# EAGLE schematic hand_rev_1_3_c (EAGLE 9.4.2)
DATE: 2019.07.02; REV: 1.2b
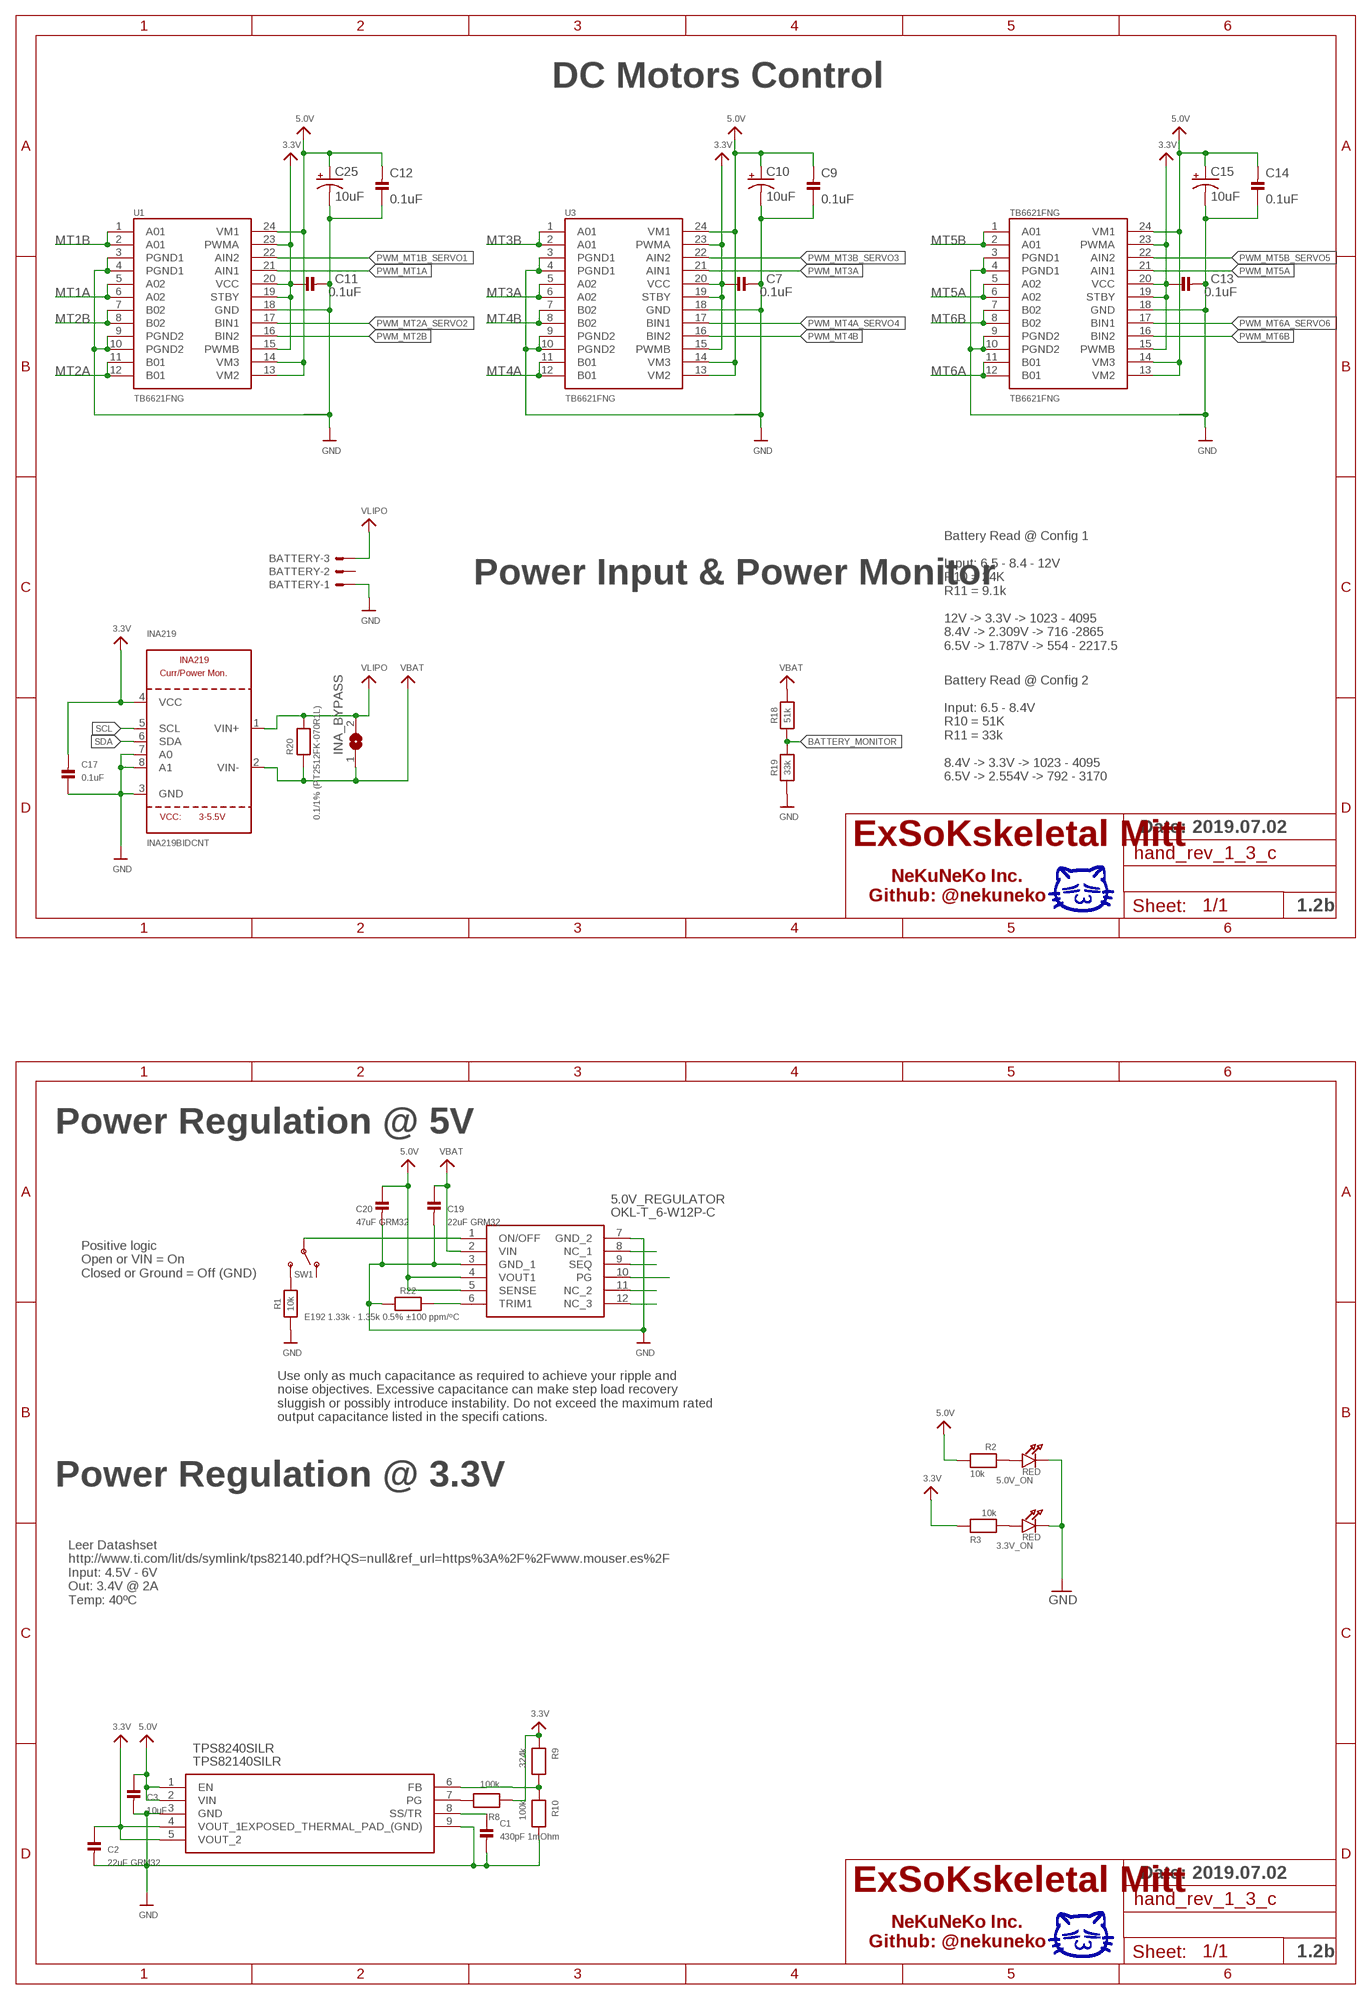
[diagram p0: schematic, sheet 1, part 1 of 2]
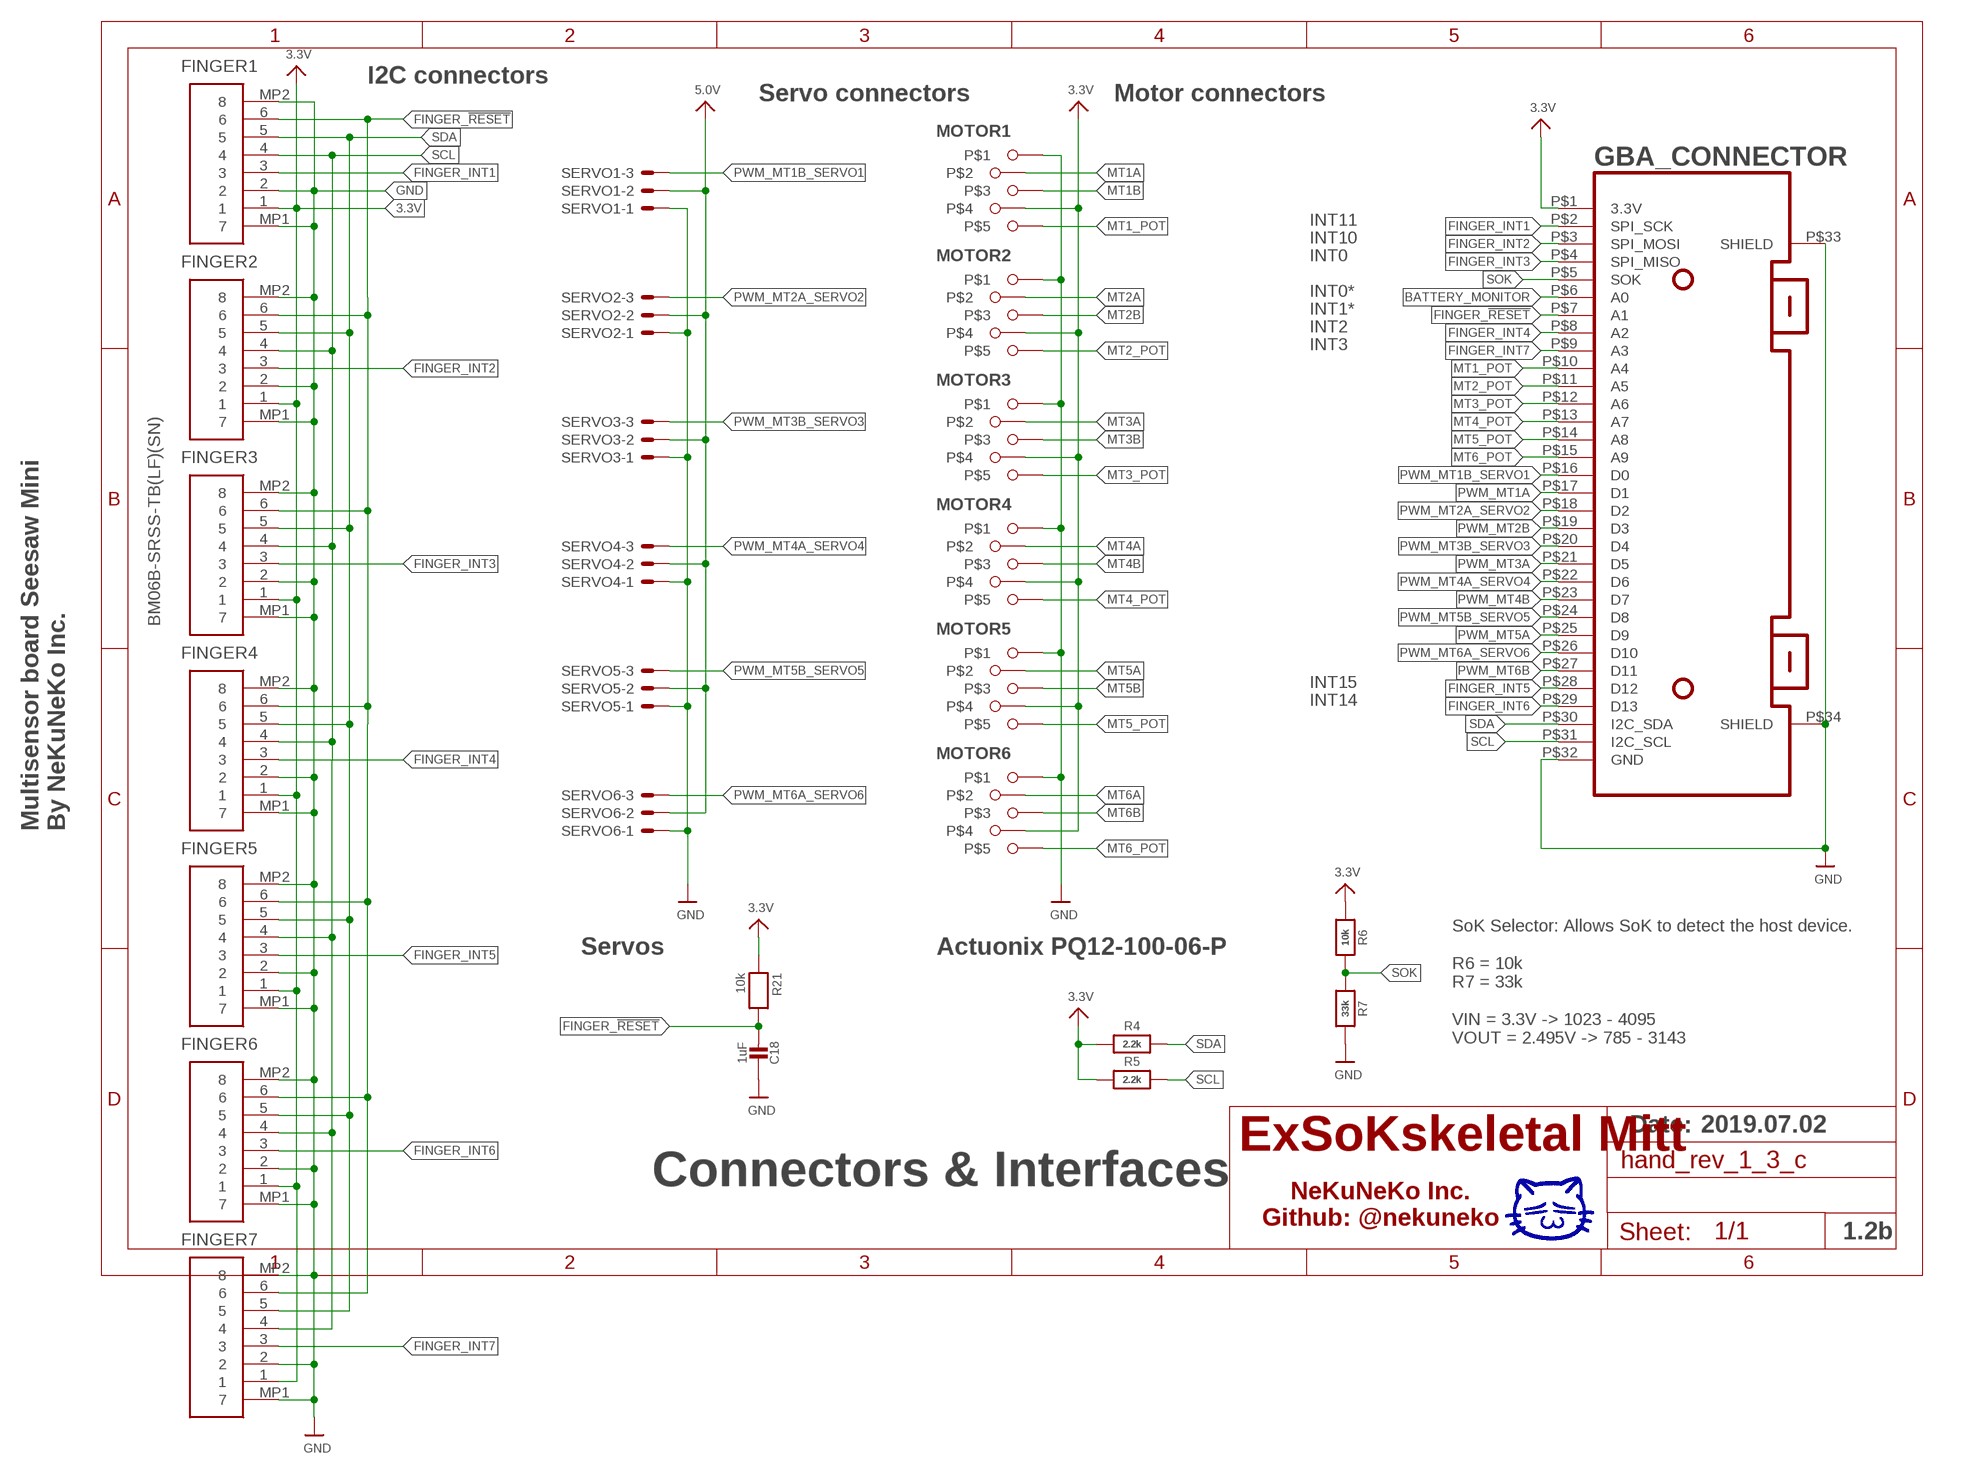
[diagram p1: schematic, sheet 1, part 2 of 2]

## Parts
3.3V_ON  RED  LED0603  [CHIPLED_0603]
5.0V_ON  RED  LED0603  [CHIPLED_0603]
5.0V_REGULATOR  OKL-T_6-W12P-C  [OKL-T3-W12]
BATTERY  JST-XH-03-PIN-LONG-PAD  [JST-XH-03-PACKAGE-LONG-PAD]
C1  430pF 1mOhm  CAP_CERAMIC_0402  [_0402]
C2  22uF GRM32  CAP_CERAMIC_0603  [_0603]
C3  10uF  CAP_CERAMIC_0603  [_0603]
C7  0.1uF  CAP_CERAMIC_0603  [_0603]
C9  0.1uF  CAP_CERAMIC_0603  [_0603]
C10  10uF  10UF-POLAR-0603-6.3V-20%(TANT)  [0603-POLAR]
C11  0.1uF  CAP_CERAMIC_0603  [_0603]
C12  0.1uF  CAP_CERAMIC_0603  [_0603]
C13  0.1uF  CAP_CERAMIC_0603  [_0603]
C14  0.1uF  CAP_CERAMIC_0603  [_0603]
C15  10uF  10UF-POLAR-0603-6.3V-20%(TANT)  [0603-POLAR]
C17  0.1uF  CAP_CERAMIC_0603  [_0603]
C18  1uF  CAP_CERAMIC_0603  [MICROBUILDER__0603]
C19  22uF GRM32  CAP_CERAMIC0805  [0805]
C20  47uF GRM32  CAP_CERAMIC0805  [0805]
C25  10uF  10UF-POLAR-0603-6.3V-20%(TANT)  [0603-POLAR]
FINGER1  BM06B-SRSS-TB(LF)(SN)  [BM06BSRSSTBLFSN]
FINGER2  BM06B-SRSS-TB(LF)(SN)  [BM06BSRSSTBLFSN]
FINGER3  BM06B-SRSS-TB(LF)(SN)  [BM06BSRSSTBLFSN]
FINGER4  BM06B-SRSS-TB(LF)(SN)  [BM06BSRSSTBLFSN]
FINGER5  BM06B-SRSS-TB(LF)(SN)  [BM06BSRSSTBLFSN]
FINGER6  BM06B-SRSS-TB(LF)(SN)  [BM06BSRSSTBLFSN]
FINGER7  BM06B-SRSS-TB(LF)(SN)  [BM06BSRSSTBLFSN]
GBA_CONNECTOR  GBA_CARTRIDGEGBA_CARTRIDGE2  [GBA_CARTRIDGE2]
INA219  INA219BIDCNT  INA219  [SOT23-8]
INA_BYPASS  SOLDERJUMPERREFLOW_NOPASTE  [SOLDERJUMPER_REFLOW_NOPASTE]
MOTOR1  Actuonix PQ12-100-06-P  5PIN  [5PIN]
MOTOR2  Actuonix PQ12-100-06-P  5PIN  [5PIN]
MOTOR3  Actuonix PQ12-100-06-P  5PIN  [5PIN]
MOTOR4  Actuonix PQ12-100-06-P  5PIN  [5PIN]
MOTOR5  Actuonix PQ12-100-06-P  5PIN  [5PIN]
MOTOR6  Actuonix PQ12-100-06-P  5PIN  [5PIN]
R1  10k  RESISTOR_0603  [_0603]
R2  10k  RESISTOR_0603  [_0603]
R3  10k  RESISTOR_0603  [_0603]
R4  2.2k  RESISTOR_0603  [_0603]
R5  2.2k  RESISTOR_0603  [_0603]
R6  10k  RESISTOR_0603  [_0603]
R7  33k  RESISTOR_0603  [_0603]
R8  100k  RESISTOR_0402  [_0402]
R9  324k  RESISTOR_0402  [_0402]
R10  100k  RESISTOR_0402  [_0402]
R18  51k  RESISTOR_0603  [_0603]
R19  33k  RESISTOR_0603  [_0603]
R20  0.1/1% (PT2512FK-070R1L)  RESISTOR2512  [2512]
R21  10k  RESISTOR_0603  [_0603]
R22  E192 1.33k - 1.35k 0.5% ±100 ppm/ºC  RESISTOR_0603  [_0603]
SERVO1  JST-XH-03-PIN-LONG-PAD  [JST-XH-03-PACKAGE-LONG-PAD]
SERVO2  JST-XH-03-PIN-LONG-PAD  [JST-XH-03-PACKAGE-LONG-PAD]
SERVO3  JST-XH-03-PIN-LONG-PAD  [JST-XH-03-PACKAGE-LONG-PAD]
SERVO4  JST-XH-03-PIN-LONG-PAD  [JST-XH-03-PACKAGE-LONG-PAD]
SERVO5  JST-XH-03-PIN-LONG-PAD  [JST-XH-03-PACKAGE-LONG-PAD]
SERVO6  JST-XH-03-PIN-LONG-PAD  [JST-XH-03-PACKAGE-LONG-PAD]
SW1  SWITCH_SPDT  [SPDT_SMT_SSSS811101]
TB6621FNG  TB6621FNG  [SSOP24]
TPS8240SILR  TPS82140SILR  [SIL0008D]
U1  TB6621FNG  [SSOP24]
U3  TB6621FNG  [SSOP24]

## Nets
3.3V: C2.1 C7.1 C11.1 C13.1 C17.2 FINGER1.1 FINGER2.1 FINGER3.1 FINGER4.1 FINGER5.1 FINGER6.1 FINGER7.1 GBA_CONNECTOR.P$1(3.3V) INA219.4(VCC) MOTOR1.4 MOTOR2.4 MOTOR3.4 MOTOR4.4 MOTOR5.4 MOTOR6.4 R3.1 R4.1 R5.1 R6.1 R8.1 R9.1 R21.1 TB6621FNG.15(PWMB) TB6621FNG.19(STBY) TB6621FNG.20(VCC) TB6621FNG.23(PWMA) TPS8240SILR.4(VOUT_1) TPS8240SILR.5(VOUT_2) U1.15(PWMB) U1.19(STBY) U1.20(VCC) U1.23(PWMA) U3.15(PWMB) U3.19(STBY) U3.20(VCC) U3.23(PWMA)
5.0V: 5.0V_REGULATOR.4(VOUT1) 5.0V_REGULATOR.5(SENSE) C3.1 C9.2 C10.+ C12.2 C14.2 C15.+ C20.1 C25.+ R2.2 SERVO1.2 SERVO2.2 SERVO3.2 SERVO4.2 SERVO5.2 SERVO6.2 TB6621FNG.13(VM2) TB6621FNG.14(VM3) TB6621FNG.24(VM1) TPS8240SILR.1(EN) TPS8240SILR.2(VIN) U1.13(VM2) U1.14(VM3) U1.24(VM1) U3.13(VM2) U3.14(VM3) U3.24(VM1)
5V_GOOD: 5.0V_REGULATOR.10(PG)
BATTERY_MONITOR: GBA_CONNECTOR.P$6(A0) R18.1 R19.2
FINGER_!RESET: C18.2 FINGER1.6 FINGER2.6 FINGER3.6 FINGER4.6 FINGER5.6 FINGER6.6 FINGER7.6 GBA_CONNECTOR.P$7(A1) R21.2
FINGER_INT1: FINGER1.3 GBA_CONNECTOR.P$2(SPI_SCK)
FINGER_INT2: FINGER2.3 GBA_CONNECTOR.P$3(SPI_MOSI)
FINGER_INT3: FINGER3.3 GBA_CONNECTOR.P$4(SPI_MISO)
FINGER_INT4: FINGER4.3 GBA_CONNECTOR.P$8(A2)
FINGER_INT5: FINGER5.3 GBA_CONNECTOR.P$28(D12)
FINGER_INT6: FINGER6.3 GBA_CONNECTOR.P$29(D13)
FINGER_INT7: FINGER7.3 GBA_CONNECTOR.P$9(A3)
GND [gnd]: 3.3V_ON.C 5.0V_ON.C 5.0V_REGULATOR.3(GND_1) 5.0V_REGULATOR.7(GND_2) BATTERY.1 C1.2 C2.2 C3.2 C7.2 C9.1 C10.- C11.2 C12.1 C13.2 C14.1 C15.- C17.1 C18.1 C19.2 C20.2 C25.- FINGER1.2 FINGER1.MP1 FINGER1.MP2 FINGER2.2 FINGER2.MP1 FINGER2.MP2 FINGER3.2 FINGER3.MP1 FINGER3.MP2 FINGER4.2 FINGER4.MP1 FINGER4.MP2 FINGER5.2 FINGER5.MP1 FINGER5.MP2 FINGER6.2 FINGER6.MP1 FINGER6.MP2 FINGER7.2 FINGER7.MP1 FINGER7.MP2 GBA_CONNECTOR.P$32(GND) GBA_CONNECTOR.P$33(SHIELD) GBA_CONNECTOR.P$34(SHIELD) INA219.3(GND) INA219.7(A0) INA219.8(A1) MOTOR1.1 MOTOR2.1 MOTOR3.1 MOTOR4.1 MOTOR5.1 MOTOR6.1 R1.1 R7.2 R10.2 R19.1 R22.2 SERVO1.1 SERVO2.1 SERVO3.1 SERVO4.1 SERVO5.1 SERVO6.1 TB6621FNG.3(PGND1) TB6621FNG.4(PGND1) TB6621FNG.9(PGND2) TB6621FNG.10(PGND2) TB6621FNG.18(GND) TPS8240SILR.3(GND) TPS8240SILR.9(EXPOSED_THERMAL_PAD_(GND)) U1.3(PGND1) U1.4(PGND1) U1.9(PGND2) U1.10(PGND2) U1.18(GND) U3.3(PGND1) U3.4(PGND1) U3.9(PGND2) U3.10(PGND2) U3.18(GND)
MT1_POT: GBA_CONNECTOR.P$10(A4) MOTOR1.5
MT1A: MOTOR1.2 U1.5(A02) U1.6(A02)
MT1B: MOTOR1.3 U1.1(A01) U1.2(A01)
MT2_POT: GBA_CONNECTOR.P$11(A5) MOTOR2.5
MT2A: MOTOR2.2 U1.11(B01) U1.12(B01)
MT2B: MOTOR2.3 U1.7(B02) U1.8(B02)
MT3_POT: GBA_CONNECTOR.P$12(A6) MOTOR3.5
MT3A: MOTOR3.2 U3.5(A02) U3.6(A02)
MT3B: MOTOR3.3 U3.1(A01) U3.2(A01)
MT4_POT: GBA_CONNECTOR.P$13(A7) MOTOR4.5
MT4A: MOTOR4.2 U3.11(B01) U3.12(B01)
MT4B: MOTOR4.3 U3.7(B02) U3.8(B02)
MT5_POT: GBA_CONNECTOR.P$14(A8) MOTOR5.5
MT5A: MOTOR5.2 TB6621FNG.5(A02) TB6621FNG.6(A02)
MT5B: MOTOR5.3 TB6621FNG.1(A01) TB6621FNG.2(A01)
MT6_POT: GBA_CONNECTOR.P$15(A9) MOTOR6.5
MT6A: MOTOR6.2 TB6621FNG.11(B01) TB6621FNG.12(B01)
MT6B: MOTOR6.3 TB6621FNG.7(B02) TB6621FNG.8(B02)
N$1: R1.2 SW1.C(S)
N$2: R8.2 TPS8240SILR.7(PG)
N$3: 5.0V_REGULATOR.8(NC_1)
N$4: 5.0V_REGULATOR.9(SEQ)
N$5: 5.0V_REGULATOR.6(TRIM1) R22.1
N$6: 5.0V_REGULATOR.11(NC_2)
N$7: R9.2 R10.1 TPS8240SILR.6(FB)
N$8: 5.0V_REGULATOR.12(NC_3)
N$9: 5.0V_ON.A R2.1
N$10: 3.3V_ON.A R3.2
PWM_MT1A: GBA_CONNECTOR.P$17(D1) U1.21(AIN1)
PWM_MT1B_SERVO1: GBA_CONNECTOR.P$16(D0) SERVO1.3 U1.22(AIN2)
PWM_MT2A_SERVO2: GBA_CONNECTOR.P$18(D2) SERVO2.3 U1.17(BIN1)
PWM_MT2B: GBA_CONNECTOR.P$19(D3) U1.16(BIN2)
PWM_MT3A: GBA_CONNECTOR.P$21(D5) U3.21(AIN1)
PWM_MT3B_SERVO3: GBA_CONNECTOR.P$20(D4) SERVO3.3 U3.22(AIN2)
PWM_MT4A_SERVO4: GBA_CONNECTOR.P$22(D6) SERVO4.3 U3.17(BIN1)
PWM_MT4B: GBA_CONNECTOR.P$23(D7) U3.16(BIN2)
PWM_MT5A: GBA_CONNECTOR.P$25(D9) TB6621FNG.21(AIN1)
PWM_MT5B_SERVO5: GBA_CONNECTOR.P$24(D8) SERVO5.3 TB6621FNG.22(AIN2)
PWM_MT6A_SERVO6: GBA_CONNECTOR.P$26(D10) SERVO6.3 TB6621FNG.17(BIN1)
PWM_MT6B: GBA_CONNECTOR.P$27(D11) TB6621FNG.16(BIN2)
REG_5V_ON: 5.0V_REGULATOR.1(ON/OFF) SW1.B(P)
SCL: FINGER1.4 FINGER2.4 FINGER3.4 FINGER4.4 FINGER5.4 FINGER6.4 FINGER7.4 GBA_CONNECTOR.P$31(I2C_SCL) INA219.5(SCL) R5.2
SDA: FINGER1.5 FINGER2.5 FINGER3.5 FINGER4.5 FINGER5.5 FINGER6.5 FINGER7.5 GBA_CONNECTOR.P$30(I2C_SDA) INA219.6(SDA) R4.2
SOK: GBA_CONNECTOR.P$5(SOK) R6.2 R7.1
SS_TR: C1.1 TPS8240SILR.8(SS/TR)
VBAT: 5.0V_REGULATOR.2(VIN) C19.1 INA219.2(VIN-) INA_BYPASS.1 R18.2 R20.1
VLIPO: BATTERY.3 INA219.1(VIN+) INA_BYPASS.2 R20.2
Unconnected: BATTERY.2 SW1.A(O)

## Notes on the sheet
- I2C connectors
- Servo connectors | Motor connectors
- DC Motors Control
- INT11
- INT10
- INT0
- INT0*
- INT1*
- INT2
- INT3
- INT15
- INT14
- Power Input & Power Monitor
- Multisensor board Seesaw Mini
  By NeKuNeKo Inc.
- Battery Read @ Config 1
  
  Input: 6.5 - 8.4 - 12V
  R10 = 24K
  R11 = 9.1k
  
  12V -> 3.3V -> 1023 - 4095
  8.4V -> 2.309V -> 716 -2865
  6.5V -> 1.787V -> 554 - 2217.5
- Servos | Actuonix PQ12-100-06-P
- SoK Selector: Allows SoK to detect the host device.
  
  R6 = 10k
  R7 = 33k 
  
  VIN = 3.3V -> 1023 - 4095
  VOUT = 2.495V -> 785 - 3143
- Battery Read @ Config 2
  
  Input: 6.5 - 8.4V
  R10 = 51K
  R11 = 33k
  
  8.4V -> 3.3V -> 1023 - 4095
  6.5V -> 2.554V -> 792 - 3170
- Date: | Date:
- ExSoKskeletal Mitt | ExSoKskeletal Mitt
- Connectors & Interfaces
- NeKuNeKo Inc.
  Github: @nekuneko
- NeKuNeKo Inc.
  Github: @nekuneko
- Power Regulation @ 5V
- Positive logic
  Open or VIN = On
  Closed or Ground = Off (GND)
- Use only as much capacitance as required to achieve your ripple and
  noise objectives. Excessive capacitance can make step load recovery
  sluggish or possibly introduce instability. Do not exceed the maximum rated
  output capacitance listed in the specifi cations.
- Power Regulation @ 3.3V
- Leer Datashset
  http://www.ti.com/lit/ds/symlink/tps82140.pdf?HQS=null&ref_url=https%3A%2F%2Fwww.mouser.es%2F
  Input: 4.5V - 6V
  Out: 3.4V @ 2A
  Temp: 40ºC
- Date:
- ExSoKskeletal Mitt
- NeKuNeKo Inc.
  Github: @nekuneko

## Library data of the parts
3.3V_ON 5.0V_ON = microbuilder:LED: LED 0603 - 0603 Surface Mount Package 2mA: Green LED - Low Power (3.9mcd, 2ma, 1.7Vf) - Digikey: 475-2709-2-ND Orange LED - Low Power (9.8mcd, 2ma, 1.8Vf) - Digikey: 475-1194-2-ND Red LED - Low Power (5mcd, 2ma, 1.8Vf) - Digikey: 475-1195-2-ND Yellow LED - Low Power (7mcd, 2ma, 1.8Vf) - Digikey: 475-1196-2-ND 5mA: Blue LED - Low Power (17mcd, 5ma, 2.9Vf) - Digikey: LNJ937W8CRACT-ND 0805 - 0805 Surface Mount Package 2mA: Red LED (8.8mcd, 2mA, 1.8Vf, Clear) - Low Power [Digikey: 475-2510-1-ND] Green LED (5mcd, 2mA, 1.8Vf, Clear) - Low Power [Digikey: 475-2730-1-ND] Yellow LED (11.3mcd, 2mA, 1.8Vf, Clear) - Low Power [Digikey: 475-2555-1-ND] 20mA: Red LED (104mcd, 20mA, Diffused) - LS R976 [Digikey: 475-1278-6-ND] Red LED (12mcd, 20mA, 2.0Vf, Clear) - APT2012EC [Digikey: 754-1128-1-ND] Green LED (15mcd, 20mA, 2.2Vf, Clear) - APT2012GC [Digikey: 754-1131-1-ND] Orange LED (160mcd, 20mA, 2.1Vf, Clear) - APT2012SECK [Digikey: 754-1130-1-ND] 1206 - 1206 Surface Mount Package Green LED (26mcd, 20mA, Diffused) - LG N971 [Digikey: 475-1407-6-ND] Red LED (15mcd, 20mA, Diffused) - LH N974 [Digikey: 475-1416-6-ND]
5.0V_REGULATOR = SamacSys_Parts:OKL-T_6-W12P-C: MURATA POWER SOLUTIONS - OKL-T/6-W12P-C - DC-DC CONVERTER, 0.591V TO 5.5V, MODULE Source: Datasheet <https://power.murata.com/data/power/okl-t6-w12.pdf>; DESCRIPTION: MURATA POWER SOLUTIONS - OKL-T/6-W12P-C - DC-DC CONVERTER, 0.591V TO 5.5V, MODULE; HEIGHT: mm; MANUFACTURER_NAME: Murata Electronics; MANUFACTURER_PART_NUMBER: OKL-T/6-W12P-C; MOUSER_PART_NUMBER: 580-OKL-T/6-W12P-C; MOUSER_PRICE-STOCK: https://www.mouser.com/Search/Refine.aspx?Keyword=580-OKL-T%2F6-W12P-C
BATTERY SERVO1-SERVO6 = JST XH Connectors v1-0:JST-XH-03-PIN: JST XH Connector 2 Pin Wire to board connector. Pitch: 2,54 mm, (0.100") Number of pins: 3 Created by Rembrandt Electronics www.rembrandtelectronics.com
C1-C3 C7 C9 C11-C14 C17 C19 C20 = microbuilder:CAP_CERAMIC: Ceramic Capacitors
C10 C15 C25 = SparkFun-Capacitors:10UF-POLAR: 10.0µF polarized capacitors A capacitor is a passive two-terminal electrical component used to store electrical energy temporarily in an electric field.; MPN: F981A106MMA; PROD_ID: CAP-13210
C18 = m0express:CAP_CERAMIC: Ceramic Capacitors
FINGER1-FINGER7 = 0SoK:BM06B-SRSS-TB(LF)(SN): connector,multipole PCB use,BM06B-SRSS-T JST SH Series, 1mm Pitch 6 Way 1 Row Straight PCB Header, Solder Termination, 1A Source: Datasheet <http://docs-emea.rs-online.com/webdocs/13ce/0900766b813ce45e.pdf>; DESCRIPTION: connector,multipole PCB use,BM06B-SRSS-T JST SH Series, 1mm Pitch 6 Way 1 Row Straight PCB Header, Solder Termination, 1A; HEIGHT: 4.25mm; MANUFACTURER_NAME: JST (JAPAN SOLDERLESS TERMINALS); MANUFACTURER_PART_NUMBER: BM06B-SRSS-TB(LF)(SN); RS_PART_NUMBER: 5468782; RS_PRICE-STOCK: https://uk.rs-online.com/web/p/products/5468782
GBA_CONNECTOR = 0SoK:GBA_CARTRIDGE: GBA Cartridge Slot for NDS - from Aliexpress Gontak SoK main interface
INA219 = microbuilder:INA219: INA219 - I2C Current/Power Monitor Voltage Range: 0-26V Accuracy: 0.5% Temperature: -40°C - 125°C
INA_BYPASS = microbuilder:SOLDERJUMPER: SMD Solder JUMPER Solder the two pads together to create a connection, or remove the solder to break it. REFLOW - Use this footprint for solder paste and reflow ovens. WAVE - Use this footprint for hand-soldering (larger pads). CLOSED - Has a trace between the two pads to ensure it is closed by default. The trace needs to be cut to disable the jumper, and can be closed again by creating a solder bridge between the two pads.
MOTOR1-MOTOR6 = 0SoK:5PIN
R1-R10 R18-R22 = microbuilder:RESISTOR: Resistors 0402 - 0402 Surface Mount Package 22 Ohm 1% 1/16W [Digikey: 311-22.0LRTR-ND] 33 Ohm 5% 1/16W 1.0K 5% 1/16W 1.5K 5% 1/16W 2.0K 1% 1/16W 10.0K 1% 1/16W [Digikey: 311-10.0KLRTR-ND] 10.0K 5% 1/16W [Digikey: RMCF0402JT10K0TR-ND] 12.1K 1% 1/16W [Digikey: 311-22.0LRTR-ND] 100.0K 5% 1/16W 0603 - 0603 Surface Mount Package 0 Ohm 1/10 Watt 1% Resistor 15 Ohm 1/10 Watt 1% Resistor 33 Ohm 1/10 Watt 1% Resistor 49.9 Ohm 1/10 Watt 1% Resistor 100 Ohm 1/10 Watt 1% Resistor 150 Ohm 1/10 Watt 1% Resistor 240 Ohm 1/10 Watt 1% Resistor 390 Ohm 1/10 Watt 1% Resistor 560 Ohm 1/10 Watt 1% Resistor 680 Ohm 1/10 Watt 1% Resistor 750 Ohm 1/10 Watt 1% Resistor 1.0K Ohm 1/10 Watt 1% Resistor 1.5K Ohm 1/10 Watt 1% Resistor 2.0K Ohm 1/10 Watt 1% Resistor 2.2K Ohm 1/10 Watt 1% Resistor 3.3K Ohm 1/10 Watt 1% Resistor 4.7K Ohm 1/10 Watt 1% Resistor 10.0K Ohm 1/10 Watt 1% Resistor 12.0K Ohm 1/10 Watt 1% Resistor 12.1K Ohm 1/10 Watt 1% Resistor 20.0K Ohm 1/10 Watt 1% Resistor 33.0K Ohm 1/10 Watt 1% Resistor 100.0K Ohm 1/10 Watt 1% Resistor 0805 - 0805 Surface Mount Package 0 Ohm 1/8 Watt 1% Resistor 33 Ohm 1/8 Watt 1% Resistor 100 Ohm 1/8 Watt 1% Resistor 150 Ohm 1/8 Watt 1% Resistor 200 Ohm 1/8 Watt 1% Resistor 240 Ohm 1/8 Watt 1% Resistor 330 Ohm 1/8 Watt 1% Resistor 390 Ohm 1/8 Watt 1% Resistor 470 Ohm 1/8 Watt 1% Resistor 1.0K Ohm 1/8 Watt 1% Resistor 1.5K Ohm 1/8 Watt 1% Resistor 2.0K Ohm 1/8 Watt 1% Resistor 4.7K Ohm 1/8 Watt 1% Resistor 5.1K Ohm 1/8 Watt 1% Resistor 5.6K Ohm 1/8 Watt 1% Resistor 10.0K Ohm 1/8 Watt 1% Resistor 22.0K Ohm 1/8 Watt 1% Resistor 33.0K Ohm 1/8 Watt 1% Resistor 100K Ohm 1/8 Watt 1% Resistor 1206 - 1206 Surface Mount Package 2012 - 2010 Surface Mount Package 0.11 Ohm 1/2 Watt 1% Resistor - Digikey: RHM.11UCT-ND
SW1 = microbuilder:SWITCH_SPDT: Switch - SPDT SSSS811101 - Horizontal Two Position SMT, 0.3A 4V [Mouser: 688-SSSS811101]
TB6621FNG U1 U3 = SparkFun:TB6621FNG: Toshiba 1A motor driver
TPS8240SILR = SamacSys_Parts:TPS82140SILR: Non-Isolated DC/DC Converters 17V Input 2A Synchronous Step-Down Converter Module With Integrated MicroSiP 8-uSiP -40 to 125 Source: Datasheet <http://www.ti.com/lit/ds/symlink/tps82140.pdf>; DESCRIPTION: Non-Isolated DC/DC Converters 17V Input 2A Synchronous Step-Down Converter Module With Integrated MicroSiP 8-uSiP -40 to 125; HEIGHT: mm; MANUFACTURER_NAME: Texas Instruments; MANUFACTURER_PART_NUMBER: TPS82140SILR; MOUSER_PART_NUMBER: 595-TPS82140SILR; MOUSER_PRICE-STOCK: https://www.mouser.com/Search/Refine.aspx?Keyword=595-TPS82140SILR

## Net classes
1 power: width 0.254 mm, drill 0.61 mm, clearance 0.254 mm
2 gnd: width 0.254 mm, drill 0.61 mm, clearance 0.254 mm